# Altium schematic sheet overview.SchDoc
size A4; SheetNumber: 1; SheetTotal: 4
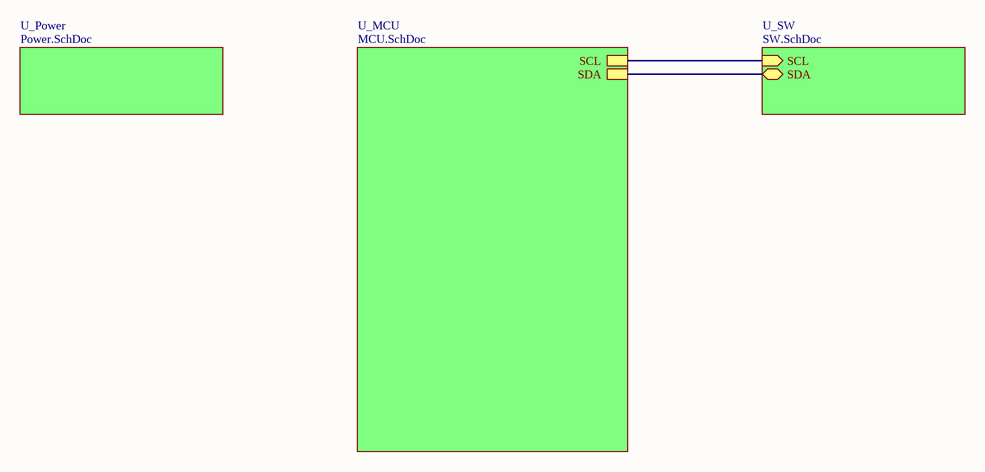
[diagram p0: overview.SchDoc]

## Sub-sheets
U_MCU = MCU.SchDoc: SDA, SCL
U_Power = Power.SchDoc: no entries
U_SW = SW.SchDoc: SCL (in), SDA (bidir)

## Nets
(unnamed): sheet U_MCU/SDA, sheet U_SW/SDA
(unnamed): sheet U_MCU/SCL, sheet U_SW/SCL